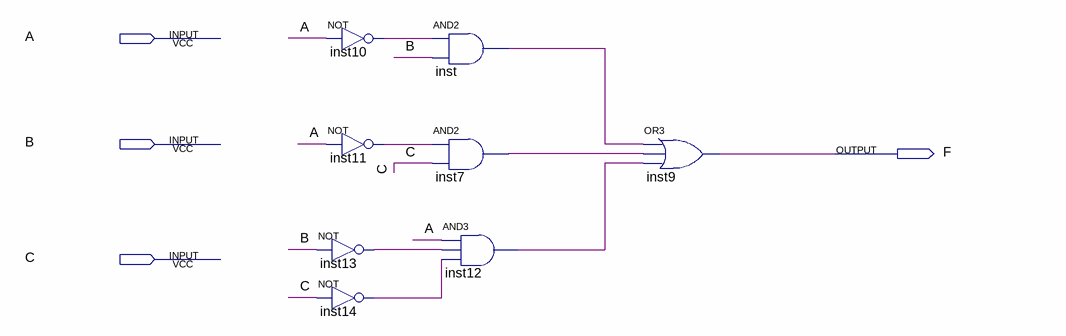
[diagram p0: schematic sheet]
// Quartus schematic test.bdf as structural Verilog: 8 symbols, 4 pins
module test (
  input  A,
  input  B,
  input  C,
  output F
);

  wire inst7_out, inst10_out, inst11_out, inst12_out, inst13_out, inst14_out, inst_out;

  not inst13 (inst13_out, B);
  not inst14 (inst14_out, C);
  not inst10 (inst10_out, A);
  not inst11 (inst11_out, A);
  and inst (inst_out, inst10_out, B);
  and inst7 (inst7_out, inst11_out, C);
  and inst12 (inst12_out, A, inst13_out, inst14_out);
  or inst9 (F, inst_out, inst7_out, inst12_out);
endmodule
